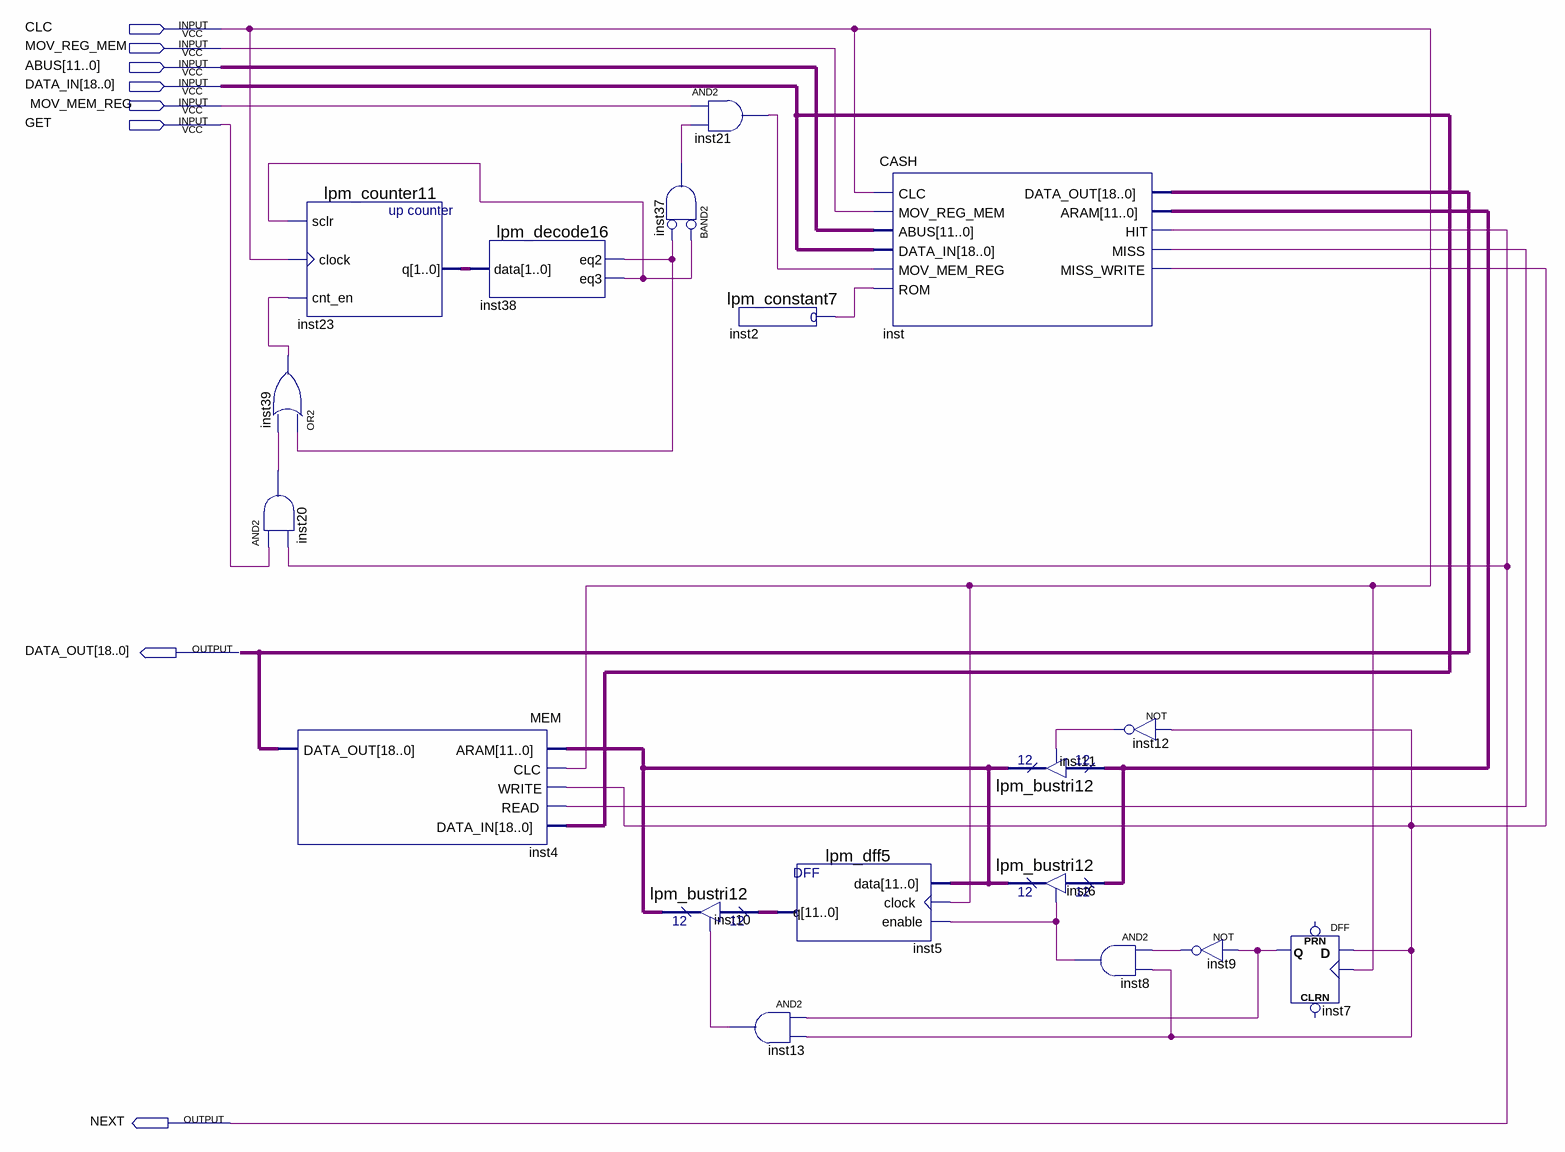
[diagram p0: schematic sheet]
// Quartus schematic MEMORY.bdf as structural Verilog: 18 symbols, 8 pins
module MEMORY (
  input  CLC,
  input  MOV_REG_MEM,
  input  [11:0] ABUS,
  input  [18:0] DATA_IN,
  input  MOV_MEM_REG,
  input  GET,
  output [18:0] DATA_OUT,
  output NEXT
);

  wire inst2_result, inst7_q, inst8_out, inst9_out, inst12_out, inst13_out, inst20_out, inst21_out,
       inst37_out, inst38_eq2, inst38_eq3, inst39_out, inst_miss, inst_miss_write;
  wire [1:0] inst23_q;
  wire [11:0] inst5_q, inst10_tridata, inst_aram;

  or inst39 (inst39_out, inst38_eq2, inst20_out);
  and inst20 (inst20_out, GET, NEXT);
  lpm_counter11 inst23 (.sclr(inst38_eq3), .clock(CLC), .cnt_en(inst39_out), .q(inst23_q));
  MEM inst4 (
    .ARAM(inst10_tridata), .CLC(CLC), .WRITE(inst_miss_write), .READ(inst_miss), .DATA_IN(DATA_IN),
    .DATA_OUT(DATA_OUT));
  lpm_decode16 inst38 (.data(inst23_q), .eq2(inst38_eq2), .eq3(inst38_eq3));
  and inst37 (inst37_out, ~inst38_eq3, ~inst38_eq2);  // BAND2
  and inst21 (inst21_out, MOV_MEM_REG, inst37_out);
  lpm_constant7 inst2 (.result(inst2_result));
  lpm_bustri12 inst10 (.enabledt(inst13_out), .data(inst5_q), .tridata(inst10_tridata));
  and inst13 (inst13_out, inst7_q, inst_miss_write);
  lpm_dff5 inst5 (.data(inst10_tridata), .clock(CLC), .enable(inst8_out), .q(inst5_q));
  CASH inst (
    .CLC(CLC), .MOV_REG_MEM(MOV_REG_MEM), .ABUS(ABUS), .DATA_IN(DATA_IN), .MOV_MEM_REG(inst21_out),
    .ROM(inst2_result), .DATA_OUT(DATA_OUT), .ARAM(inst_aram), .HIT(NEXT), .MISS(inst_miss),
    .MISS_WRITE(inst_miss_write));
  lpm_bustri12 inst11 (.enabledt(inst12_out), .data(inst_aram), .tridata(inst10_tridata));
  lpm_bustri12 inst6 (.enabledt(inst8_out), .data(inst_aram), .tridata(inst10_tridata));
  not inst12 (inst12_out, inst_miss_write);
  and inst8 (inst8_out, inst9_out, inst_miss_write);
  not inst9 (inst9_out, inst7_q);
  DFF inst7 (.CLK(CLC), .D(inst_miss_write), .Q(inst7_q));  // open: CLRN, PRN
endmodule
